# EAGLE design SBC_TMS9918A_ISA (EAGLE 9.6.2)
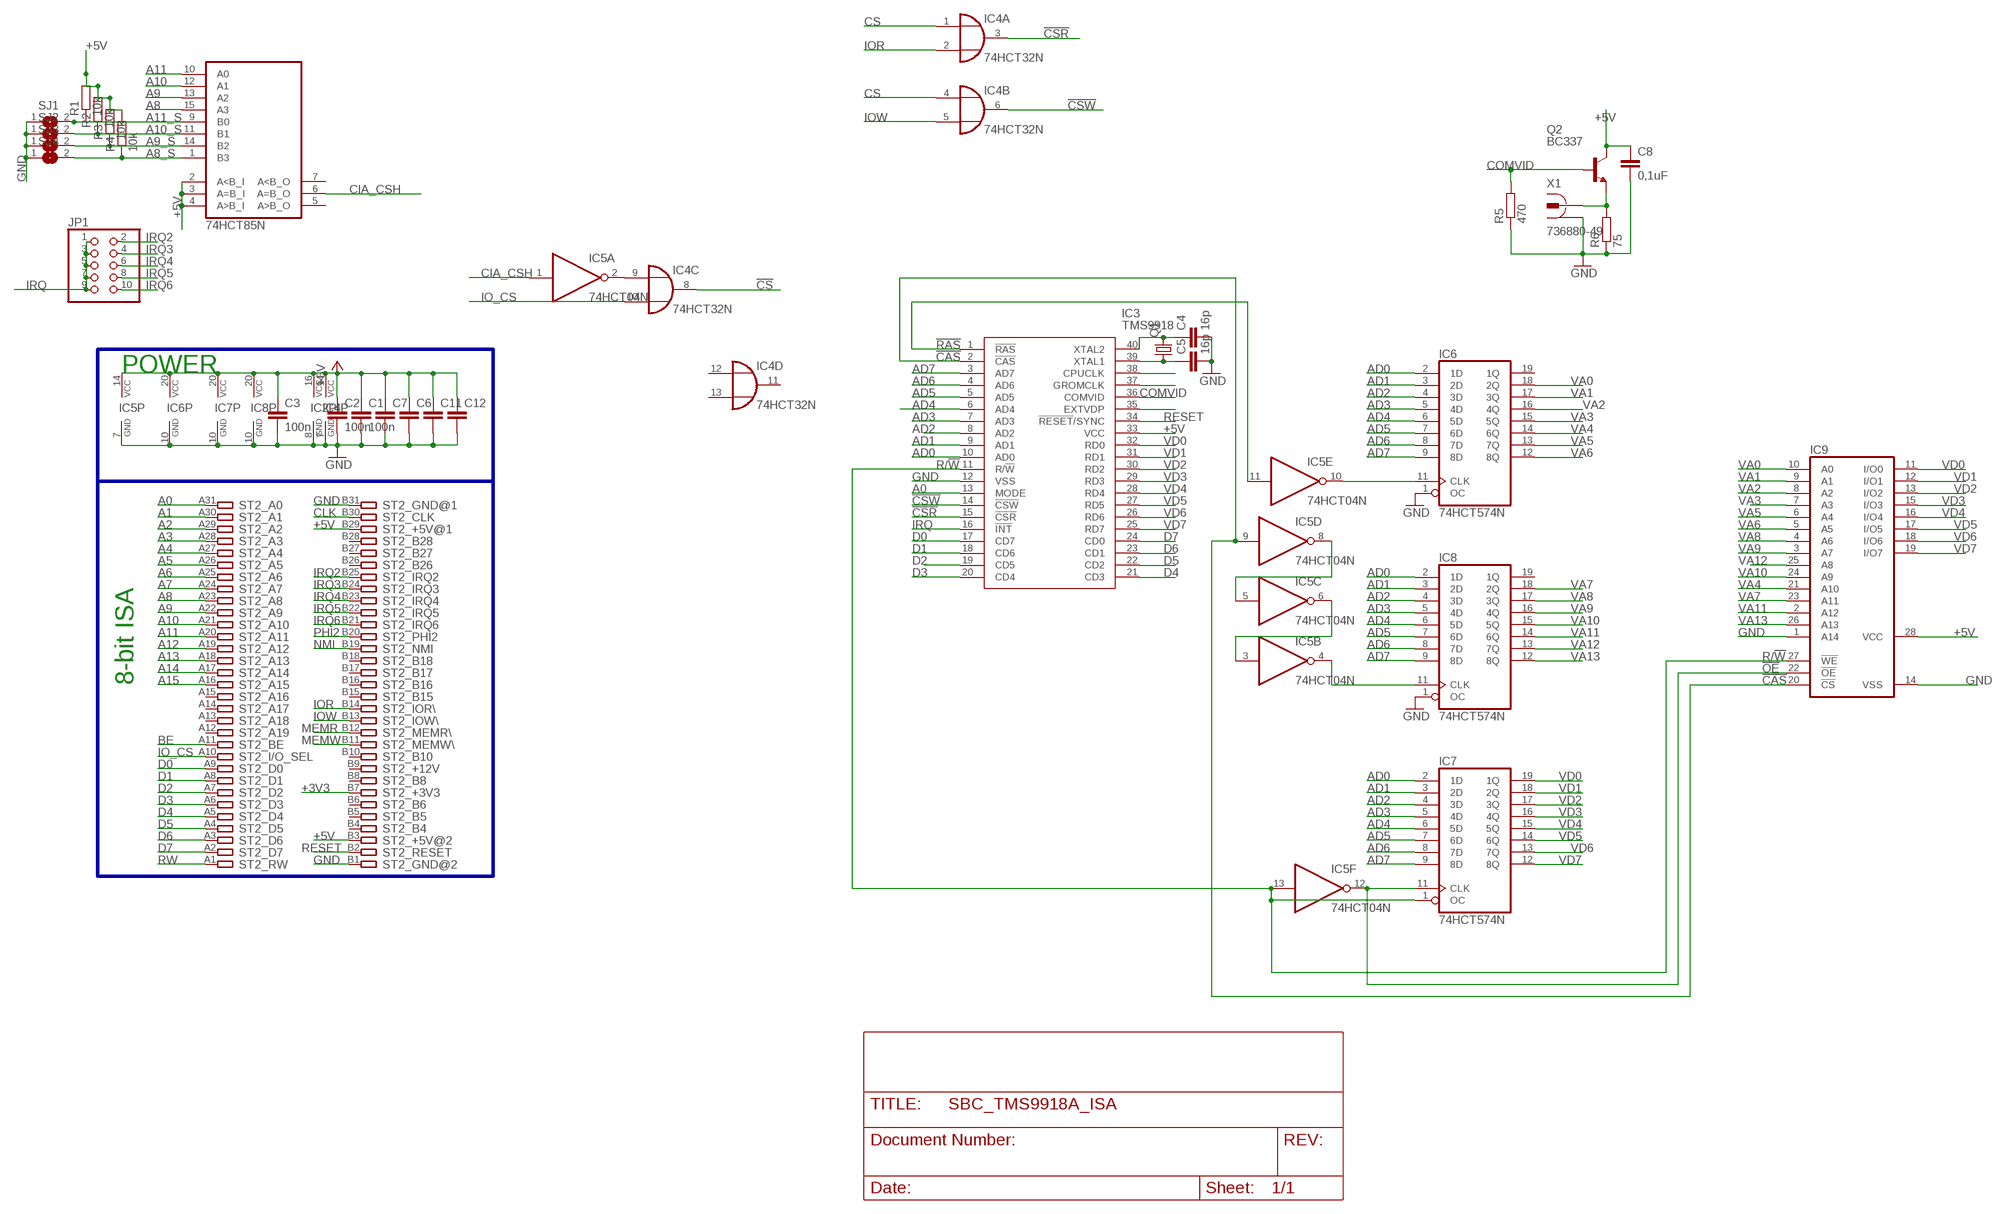
[diagram p0: schematic, sheet 1]

## Parts
C1  100n  C-EU050-025X075  [C050-025X075]
C2  100n  C-EU050-025X075  [C050-025X075]
C3  100n  C-EU050-025X075  [C050-025X075]
C4  16p  C-EU050-024X044  [C050-024X044]
C5  16p  C-EU050-024X044  [C050-024X044]
C6  C-EU050-035X075  [C050-035X075]
C7  C-EU050-035X075  [C050-035X075]
C8  0,1uF  C-EU050-024X044  [C050-024X044]
C11  C-EU050-035X075  [C050-035X075]
C12  C-EU050-035X075  [C050-035X075]
IC2  74HCT85N  [DIL16]
IC3  TMS9918  [DIP1524W53P254L5310H508Q40N]
IC4  74HCT32N  [DIL14]
IC5  74HCT04N  [DIL14]
IC6  74HCT574N  [DIL20]
IC7  74HCT574N  [DIL20]
IC8  74HCT574N  [DIL20]
IC9  62256P  [DIL28-6]
JP1  PINHD-2X5  [2X05]
Q1  CRYSTALHC49S  [HC49/S]
Q2  BC337  [TO92]
R1  10k  R-EU_0207/7  [0207/7]
R2  10k  R-EU_0207/7  [0207/7]
R3  10k  R-EU_0207/7  [0207/7]
R4  10k  R-EU_0207/7  [0207/7]
R5  470  R-EU_0207/7  [0207/7]
R6  75  R-EU_0207/7  [0207/7]
SJ1  SJ  [SJ]
SJ2  SJ  [SJ]
SJ3  SJ  [SJ]
SJ4  SJ  [SJ]
ST2  IBM8BIT_ISASHORT  [APP_2X32_SHORT]
X1  736880-49  [736880-49]

## Nets
!CAS: IC3.2(!CAS) IC5.9(D:I) IC9.20(!CS)
!CS: IC4.8(C:O)
!CSR: IC3.15(!CSR) IC4.3(A:O)
!CSW: IC3.14(!CSW) IC4.6(B:O)
!OE: IC5.12(F:O) IC7.11(CLK) IC9.22(!OE)
!RAS: IC3.1(!RAS) IC5.11(E:I)
+3V3: ST2.B7
+5V [power]: C1.1 C2.1 C3.1 C6.1 C7.1 C8.1 C11.1 C12.1 IC2.2(A<B_I) IC2.3(A=B_I) IC2.4(A>B_I) IC2.16(VCC) IC3.33(VCC) IC4.14(P:VCC) IC5.14(P:VCC) IC6.20(VCC) IC7.20(VCC) IC8.20(VCC) IC9.28(VCC) Q2.3(C) R1.2 R2.2 R3.2 R4.2 ST2.B3 ST2.B29
A0: IC3.13(MODE) ST2.A31
A1: ST2.A30
A2: ST2.A29
A3: ST2.A28
A4: ST2.A27
A5: ST2.A26
A6: ST2.A25
A7: ST2.A24
A8: IC2.15(A3) ST2.A23
A8_S: IC2.1(B3) R4.1 SJ4.2
A9: IC2.13(A2) ST2.A22
A9_S: IC2.14(B2) R3.1 SJ3.2
A10: IC2.12(A1) ST2.A21
A10_S: IC2.11(B1) R2.1 SJ2.2
A11: IC2.10(A0) ST2.A20
A11_S: IC2.9(B0) R1.1 SJ1.2
A12: ST2.A19
A13: ST2.A18
A14: ST2.A17
A15: ST2.A16
AD0: IC3.10(AD0) IC6.2(1D) IC7.2(1D) IC8.2(1D)
AD1: IC3.9(AD1) IC6.3(2D) IC7.3(2D) IC8.3(2D)
AD2: IC3.8(AD2) IC6.4(3D) IC7.4(3D) IC8.4(3D)
AD3: IC3.7(AD3) IC6.5(4D) IC7.5(4D) IC8.5(4D)
AD4: IC3.6(AD4) IC6.6(5D) IC7.6(5D) IC8.6(5D)
AD5: IC3.5(AD5) IC6.7(6D) IC7.7(6D) IC8.7(6D)
AD6: IC3.4(AD6) IC6.8(7D) IC7.8(7D) IC8.8(7D)
AD7: IC3.3(AD7) IC6.9(8D) IC7.9(8D) IC8.9(8D)
BE: ST2.A11
CIA_CSH: IC2.6(A=B_O) IC5.1(A:I)
CLK: ST2.B30
COMVID: IC3.36(COMVID) Q2.2(B) R5.2
CS: IC4.1(A:I0) IC4.4(B:I0)
D0: IC3.17(CD7) ST2.A9
D1: IC3.18(CD6) ST2.A8
D2: IC3.19(CD5) ST2.A7
D3: IC3.20(CD4) ST2.A6
D4: IC3.21(CD3) ST2.A5
D5: IC3.22(CD2) ST2.A4
D6: IC3.23(CD1) ST2.A3
D7: IC3.24(CD0) ST2.A2
GND [power]: C1.2 C2.2 C3.2 C4.2 C5.2 C6.2 C7.2 C8.2 C11.2 C12.2 IC2.8(GND) IC3.12(VSS) IC4.7(P:GND) IC5.7(P:GND) IC6.1(OC) IC6.10(GND) IC7.10(GND) IC8.1(OC) IC8.10(GND) IC9.1(A14) IC9.14(VSS) R5.1 R6.1 SJ1.1 SJ2.1 SJ3.1 SJ4.1 ST2.B1 ST2.B31 X1.1 X1.1@1 X1.1@2
IO_CS: IC4.10(C:I1) ST2.A10
IOR: IC4.2(A:I1) ST2.B14
IOW: IC4.5(B:I1) ST2.B13
IRQ: IC3.16(!INT) JP1.1 JP1.3 JP1.5 JP1.7 JP1.9
IRQ2: JP1.2 ST2.B25
IRQ3: JP1.4 ST2.B24
IRQ4: JP1.6 ST2.B23
IRQ5: JP1.8 ST2.B22
IRQ6: JP1.10 ST2.B21
MEMR: ST2.B12
MEMW: ST2.B11
N$2: IC4.9(C:I0) IC5.2(A:O)
N$3: Q2.1(E) R6.2 X1.2
N$14: IC5.10(E:O) IC6.11(CLK)
N$15: IC5.5(C:I) IC5.8(D:O)
N$16: IC5.3(B:I) IC5.6(C:O)
N$17: IC5.4(B:O) IC8.11(CLK)
N$22: C4.1 IC3.40(XTAL2) Q1.2
N$23: C5.1 IC3.39(XTAL1) Q1.1
N$24: IC3.38(CPUCLK)
N$25: IC3.37(GROMCLK)
N$27: IC3.35(EXTVDP)
NMI: ST2.B19
PHI2: ST2.B20
R/!W: IC3.11(R/!W) IC5.13(F:I) IC7.1(OC) IC9.27(!WE)
RESET: IC3.34(!RESET!/SYNC) ST2.B2
RW: ST2.A1
VA0: IC6.18(2Q) IC9.10(A0)
VA1: IC6.17(3Q) IC9.9(A1)
VA2: IC6.16(4Q) IC9.8(A2)
VA3: IC6.15(5Q) IC9.7(A3)
VA4: IC6.14(6Q) IC9.21(A10)
VA5: IC6.13(7Q) IC9.6(A4)
VA6: IC6.12(8Q) IC9.5(A5)
VA7: IC8.18(2Q) IC9.23(A11)
VA8: IC8.17(3Q) IC9.4(A6)
VA9: IC8.16(4Q) IC9.3(A7)
VA10: IC8.15(5Q) IC9.24(A9)
VA11: IC8.14(6Q) IC9.2(A12)
VA12: IC8.13(7Q) IC9.25(A8)
VA13: IC8.12(8Q) IC9.26(A13)
VD0: IC3.32(RD0) IC7.19(1Q) IC9.11(I/O0)
VD1: IC3.31(RD1) IC7.18(2Q) IC9.12(I/O1)
VD2: IC3.30(RD2) IC7.17(3Q) IC9.13(I/O2)
VD3: IC3.29(RD3) IC7.16(4Q) IC9.15(I/O3)
VD4: IC3.28(RD4) IC7.15(5Q) IC9.16(I/O4)
VD5: IC3.27(RD5) IC7.14(6Q) IC9.17(I/O5)
VD6: IC3.26(RD6) IC7.13(7Q) IC9.18(I/O6)
VD7: IC3.25(RD7) IC7.12(8Q) IC9.19(I/O7)
Unconnected: IC2.5(A>B_O) IC2.7(A<B_O) IC4.11(D:O) IC4.12(D:I0) IC4.13(D:I1) IC6.19(1Q) IC8.19(1Q) ST2.A12 ST2.A13 ST2.A14 ST2.A15 ST2.B4 ST2.B5 ST2.B6 ST2.B8 ST2.B9 ST2.B10 ST2.B15 ST2.B16 ST2.B17 ST2.B18 ST2.B26 ST2.B27 ST2.B28

## Buses
A8,A9,A10,A11,ACIA_CS,IO_CS,IO_CS_N,N$3,N$4,N$8

## Notes on the sheet
- POWER
- 8-bit ISA

## Library data of the parts
C1-C3 = rcl:C-EU: CAPACITOR, European symbol
C4-C8 C11 C12 = rcl:C-EU: CAPACITOR, European symbol; SPICEPREFIX: C
IC2 = 74xx-eu:74*85: 4-bit magnitude COMPARATOR
IC3 = TMS9918:TMS9918: Video Display Processor, DIP-40 Source: Datasheet <http://www.bitsavers.org/components/ti/TMS9900/TMS9918A_TMS9928A_TMS9929A_Video_Display_Processors_Data_Manual_Nov82.pdf>; DESCRIPTION: Video Display Processor, DIP-40; HEIGHT: 5.08mm; MANUFACTURER_NAME: Texas Instruments; MANUFACTURER_PART_NUMBER: TMS9918
IC4 = 74xx-eu:74*32: Quad 2-input OR gate
IC5 = 74xx-eu:74*04: Hex INVERTER
IC6-IC8 = 74xx-eu:74*574: 8-bit D type FLIP FLOP bus driver
IC9 = memory-hitachi:62256P: MEMORY; OC_FARNELL: unknown; OC_NEWARK: unknown
JP1 = pinhead:PINHD-2X5: PIN HEADER
Q1 = crystal:CRYSTAL: CRYSTAL; OC_FARNELL: 1667008; OC_NEWARK: unknown
Q2 = transistor-npn:BC337*: NPN Transistor
R1-R6 = rcl:R-EU_: RESISTOR, European symbol; SPICEPREFIX: R
SJ1-SJ4 = jumper:SJ: SMD solder JUMPER
ST2 = TiRoRiN_Libs:IBM8BIT_ISA: 8-bit CARD IBM/PC-AT
X1 = con-conrad:736880-49: Cinch Connector ( RCA Jack ) Cinch-Einbaukupplung 90º 72345 Vernickelt BKL Electronic Source: Conrad <http://www.conrad.de/ce/de/product/736880>

## Net classes
0 default: width 0.152 mm, drill 0.2 mm, clearance 0.152 mm
1 power: width 0.508 mm, drill 0.66 mm, clearance 0.254 mm to class 0, clearance 0.254 mm
2 data: width 0.254 mm, drill 0.66 mm, clearance 0.254 mm to class 0, clearance 0.254 mm to class 1, clearance 0.254 mm

## Board
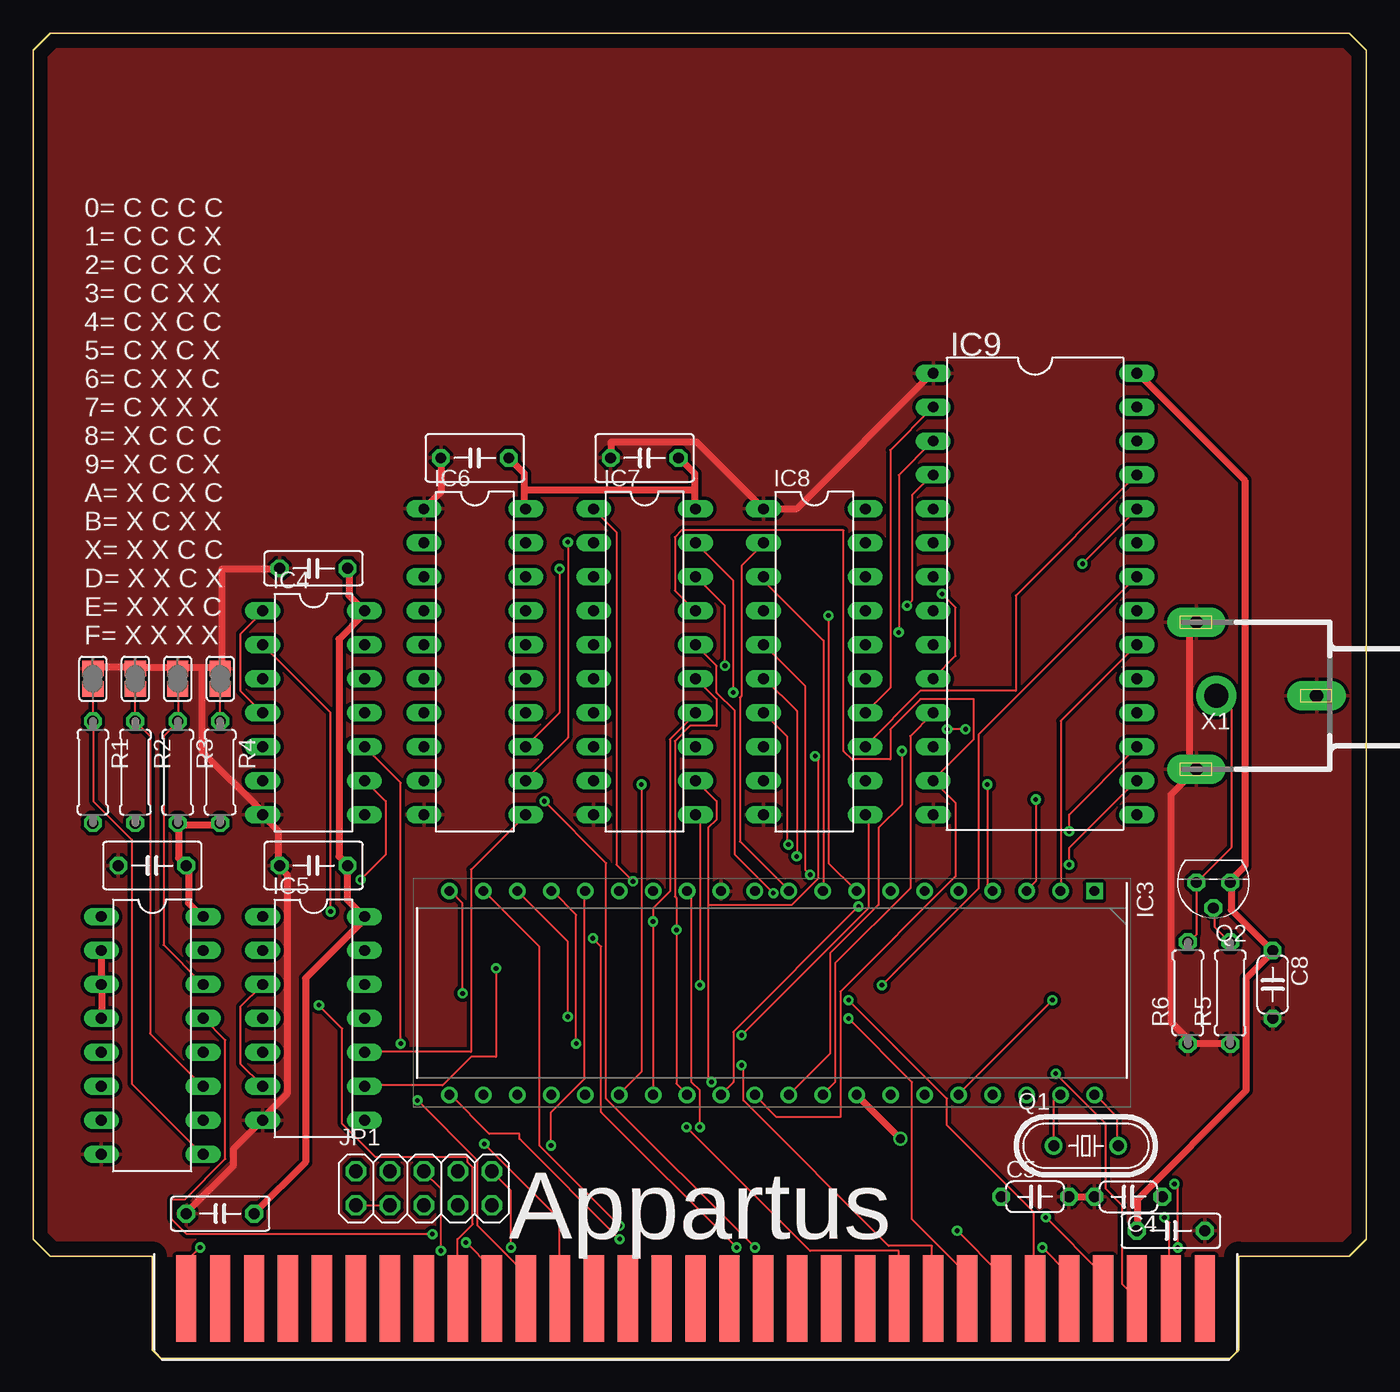
[diagram p1: board, top side]
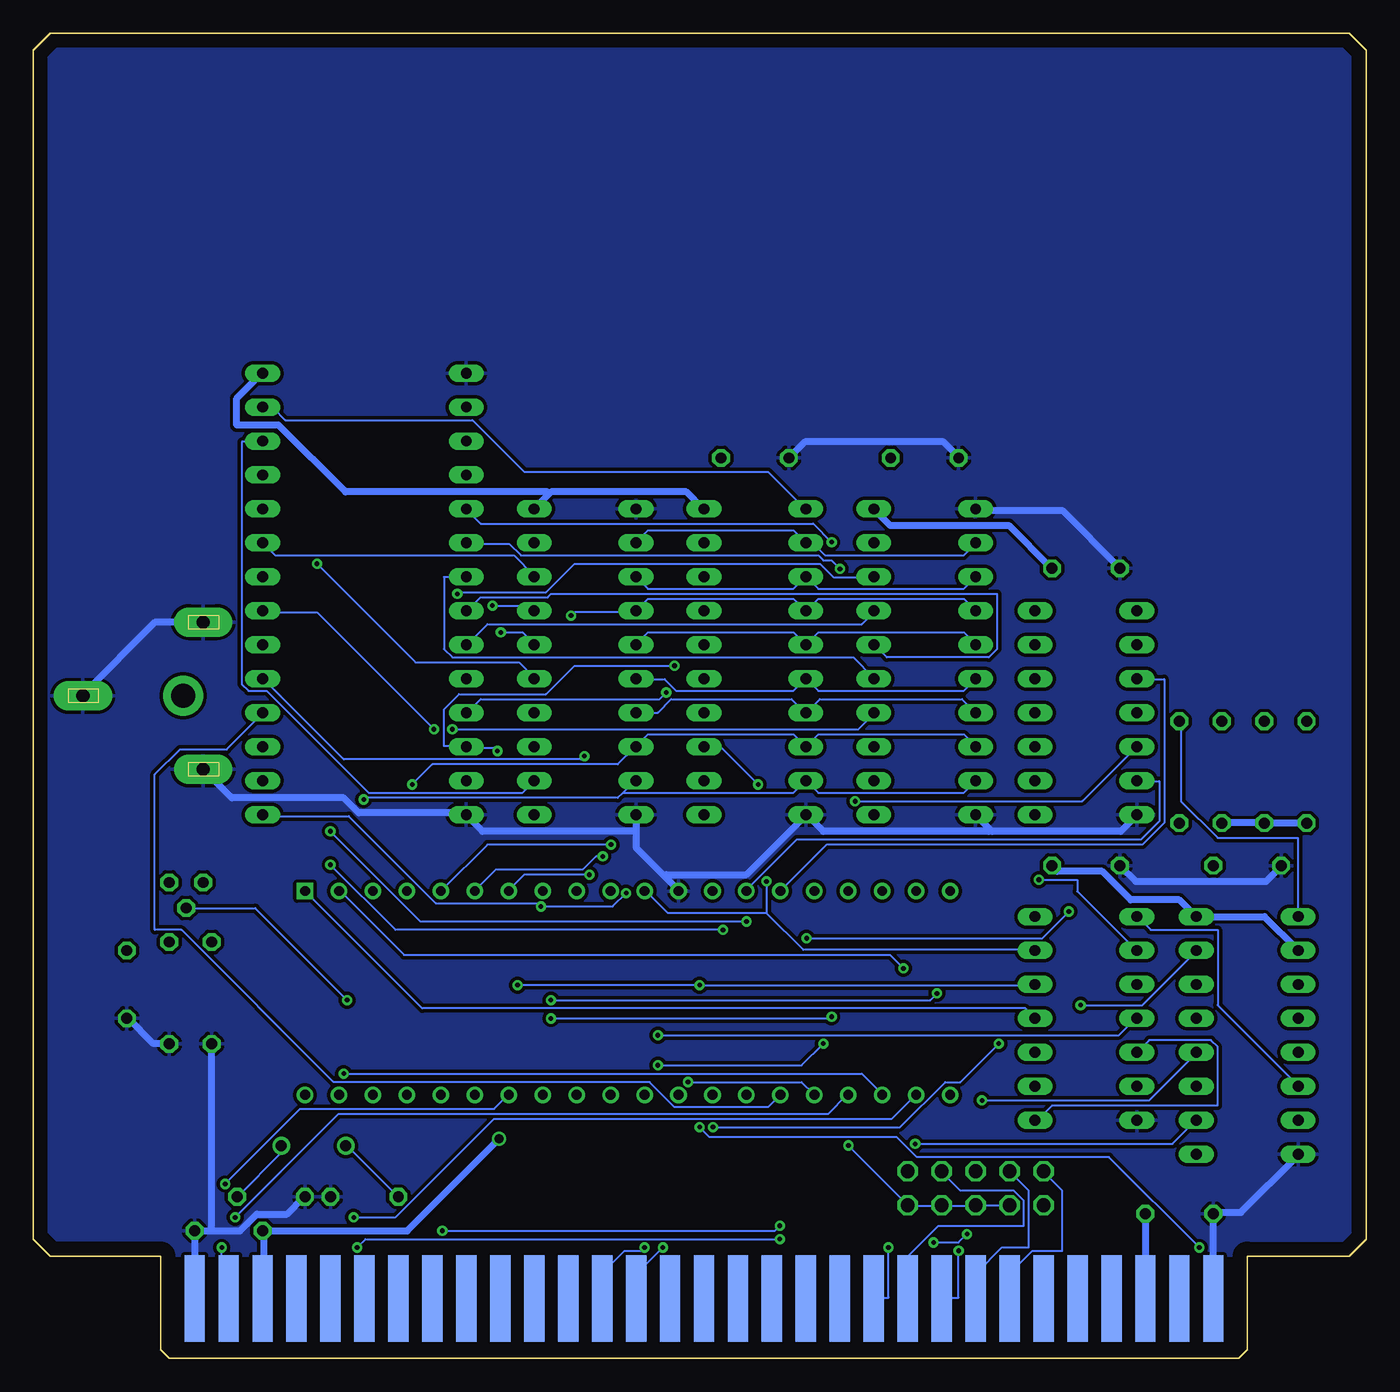
[diagram p2: board, bottom side, seen from below]

Size 99.7 x 99.06 mm. Coordinates in mm from the lower left corner, seen from the top.
Copper layers (1*16): Top 0.035mm / dielectric 1.5mm / Bottom 0.035mm
Design rules "appartus": minimum track width 6mil, minimum drill 0.35mm, track to track 6mil, track to pad 6mil, pad to pad 6mil, via to via 6mil, smd to smd 6mil, copper to edge 40mil, drill to drill 6mil, minimum pad ring 10mil, minimum via ring 8mil, stop-mask expansion 4mil, vias tented up to drill 0mil, thermal gap 10mil

### Footprints (pad centres in the part's own frame; a part is rotated, then mirrored left to right if it is on the bottom)
C050-025X075 = drill 0.813 octagon: 1 -2.54,0; 2 2.54,0
C050-024X044 = drill 0.813 octagon: 1 -2.54,0; 2 2.54,0
C050-035X075 = drill 0.813 octagon: 1 -2.54,0; 2 2.54,0
DIL16 = drill 0.813 long: 1 -8.89,-3.81; 2 -6.35,-3.81; 3 -3.81,-3.81; 4 -1.27,-3.81; 5 1.27,-3.81; 6 3.81,-3.81; 7 6.35,-3.81; 8 8.89,-3.81; 9 8.89,3.81; 10 6.35,3.81; 11 3.81,3.81; 12 1.27,3.81; 13 -1.27,3.81; 14 -3.81,3.81; 15 -6.35,3.81; 16 -8.89,3.81
DIP1524W53P254L5310H508Q40N = drill 0.733 pad 1.133 square: 1 -7.62,24.13 | drill 0.733 pad 1.133: 2 -7.62,21.59; 3 -7.62,19.05; 4 -7.62,16.51; 5 -7.62,13.97; 6 -7.62,11.43; 7 -7.62,8.89; 8 -7.62,6.35; 9 -7.62,3.81; 10 -7.62,1.27; 11 -7.62,-1.27; 12 -7.62,-3.81; 13 -7.62,-6.35; 14 -7.62,-8.89; 15 -7.62,-11.43; 16 -7.62,-13.97; 17 -7.62,-16.51; 18 -7.62,-19.05; 19 -7.62,-21.59; 20 -7.62,-24.13; 21 7.62,-24.13; 22 7.62,-21.59; 23 7.62,-19.05; 24 7.62,-16.51; 25 7.62,-13.97; 26 7.62,-11.43; 27 7.62,-8.89; 28 7.62,-6.35; 29 7.62,-3.81; 30 7.62,-1.27; 31 7.62,1.27; 32 7.62,3.81; 33 7.62,6.35; 34 7.62,8.89; 35 7.62,11.43; 36 7.62,13.97; 37 7.62,16.51; 38 7.62,19.05; 39 7.62,21.59; 40 7.62,24.13
DIL14 = drill 0.813 long: 1 -7.62,-3.81; 2 -5.08,-3.81; 3 -2.54,-3.81; 4 0,-3.81; 5 2.54,-3.81; 6 5.08,-3.81; 7 7.62,-3.81; 8 7.62,3.81; 9 5.08,3.81; 10 2.54,3.81; 11 0,3.81; 12 -2.54,3.81; 13 -5.08,3.81; 14 -7.62,3.81
DIL20 = drill 0.813 long: 1 -11.43,-3.81; 2 -8.89,-3.81; 3 -6.35,-3.81; 4 -3.81,-3.81; 5 -1.27,-3.81; 6 1.27,-3.81; 7 3.81,-3.81; 8 6.35,-3.81; 9 8.89,-3.81; 10 11.43,-3.81; 11 11.43,3.81; 12 8.89,3.81; 13 6.35,3.81; 14 3.81,3.81; 15 1.27,3.81; 16 -1.27,3.81; 17 -3.81,3.81; 18 -6.35,3.81; 19 -8.89,3.81; 20 -11.43,3.81
DIL28-6 = drill 0.813 long: 1 -16.51,-7.62; 2 -13.97,-7.62; 3 -11.43,-7.62; 4 -8.89,-7.62; 5 -6.35,-7.62; 6 -3.81,-7.62; 7 -1.27,-7.62; 8 1.27,-7.62; 9 3.81,-7.62; 10 6.35,-7.62; 11 8.89,-7.62; 12 11.43,-7.62; 13 13.97,-7.62; 14 16.51,-7.62; 15 16.51,7.62; 16 13.97,7.62; 17 11.43,7.62; 18 8.89,7.62; 19 6.35,7.62; 20 3.81,7.62; 21 1.27,7.62; 22 -1.27,7.62; 23 -3.81,7.62; 24 -6.35,7.62; 25 -8.89,7.62; 26 -11.43,7.62; 27 -13.97,7.62; 28 -16.51,7.62
2X05 = drill 1.016 octagon: 1 -5.08,-1.27; 2 -5.08,1.27; 3 -2.54,-1.27; 4 -2.54,1.27; 5 0,-1.27; 6 0,1.27; 7 2.54,-1.27; 8 2.54,1.27; 9 5.08,-1.27; 10 5.08,1.27
HC49/S = drill 0.813: 1 -2.413,0; 2 2.413,0
TO92 = drill 0.813 octagon: 1 1.27,0; 2 0,1.905; 3 -1.27,0
0207/7 = drill 0.813 octagon: 1 -3.81,0; 2 3.81,0
SJ = smd 1.168 x 1.6: 1 -0.762,0; 2 0.762,0
APP_2X32_SHORT = smd 1.524 x 6.477: A1 38.1,-44.45; A2 35.56,-44.45; A3 33.02,-44.45; A4 30.48,-44.45; A5 27.94,-44.45; A6 25.4,-44.45; A7 22.86,-44.45; A8 20.32,-44.45; A9 17.78,-44.45; A10 15.24,-44.45; A11 12.7,-44.45; A12 10.16,-44.45; A13 7.62,-44.45; A14 5.08,-44.45; A15 2.54,-44.45; A16 0,-44.45; A17 -2.54,-44.45; A18 -5.08,-44.45; A19 -7.62,-44.45; A20 -10.16,-44.45; A21 -12.7,-44.45; A22 -15.24,-44.45; A23 -17.78,-44.45; A24 -20.32,-44.45; A25 -22.86,-44.45; A26 -25.4,-44.45; A27 -27.94,-44.45; A28 -30.48,-44.45; A29 -33.02,-44.45; A30 -35.56,-44.45; A31 -38.1,-44.45 | smd 1.524 x 6.477 bottom: B1 38.1,-44.45; B2 35.56,-44.45; B3 33.02,-44.45; B4 30.48,-44.45; B5 27.94,-44.45; B6 25.4,-44.45; B7 22.86,-44.45; B8 20.32,-44.45; B9 17.78,-44.45; B10 15.24,-44.45; B11 12.7,-44.45; B12 10.16,-44.45; B13 7.62,-44.45; B14 5.08,-44.45; B15 2.54,-44.45; B16 0,-44.45; B17 -2.54,-44.45; B18 -5.08,-44.45; B19 -7.62,-44.45; B20 -10.16,-44.45; B21 -12.7,-44.45; B22 -15.24,-44.45; B23 -17.78,-44.45; B24 -20.32,-44.45; B25 -22.86,-44.45; B26 -25.4,-44.45; B27 -27.94,-44.45; B28 -30.48,-44.45; B29 -33.02,-44.45; B30 -35.56,-44.45; B31 -38.1,-44.45
736880-49 = drill 1 pad 2.2 long: 1 -3.92,0; 1@1 5.08,-5.5; 1@2 5.08,5.5 | drill 1.8 pad 3: 2 3.58,0

### Placement (x,y rotation side)
C1  13.97,10.8 180 top
C2  85.09,9.53 0 top
C3  20.96,59.05 180 top
C4  81.92,12.07 180 top
C5  74.93,12.07 0 top
C6  8.89,36.83 180 top
C7  20.96,36.83 180 top
C8  92.71,27.94 270 top
C11  33.02,67.31 180 top
C12  45.72,67.31 180 top
IC2  8.89,24.13 270 top
IC3  55.25,27.31 270 top
IC4  20.96,48.26 270 top
IC5  20.96,25.4 270 top
IC6  33.02,52.07 270 top
IC7  45.72,52.07 270 top
IC8  58.42,52.07 270 top
IC9  74.93,57.15 270 top
JP1  29.21,12.7 0 top
Q1  78.74,15.88 0 top
Q2  88.27,35.56 180 top
R1  4.45,43.82 270 top
R2  7.62,43.82 270 top
R3  10.8,43.82 270 top
R4  13.97,43.82 270 top
R5  89.54,27.31 90 top
R6  86.36,27.31 90 top
SJ1  4.45,50.8 270 top
SJ2  7.62,50.8 270 top
SJ3  10.8,50.8 270 top
SJ4  13.97,50.8 270 top
ST2  49.53,48.9 0 top
X1  92.08,49.53 180 top

### Tracks (layer width: path | path; a pad name or v marks a point on that pad's centre or on a via)
!CAS  (via drill 0.35)
  Top 0.152: IC9.20 76.86,47.65 76.86,35.02 IC3.2 | v34.61,29.15 34.61,22.52 32.73,22.52 30.61,20.4 24.86,20.4 IC5.9
  Bottom 0.152: v34.61,29.15 35.61,30.15 71.98,30.15 76.73,34.9 IC3.2
!CSR
  Bottom 0.152: IC3.15 43.73,35.02 40.36,38.4 16.73,38.4 15.11,40.02 15.11,50.77 17.11,50.77 IC4.3
!CSW
  Bottom 0.152: IC3.14 46.36,35.02 42.61,38.77 16.86,38.77 15.48,40.15 15.48,43.15 17.11,43.15 IC4.6
!OE  (via drill 0.35)
  Top 0.152: v49.86,27.9 49.86,40.27 49.61,40.52 IC7.11 | v63.48,27.9 70.73,35.15 70.73,46.65 82.48,58.4 IC9.22
  Bottom 0.152: IC5.12 24.86,27.9 v49.86,27.9 v63.48,27.9
!RAS
  Bottom 0.152: IC3.1 79.36,34.9 70.61,26.15 25.48,26.15 24.86,25.52 IC5.11
+5V  (via drill 0.66)
  Top 0.508: v64.86,16.4 61.61,19.65 IC3.33 | C2.1 82.61,9.65 82.61,11.9 90.73,20.02 90.73,28.4 92.61,30.27 C8.1 92.61,30.52 89.61,33.52 89.61,35.52 Q2.3 89.61,35.77 90.61,36.77 90.61,65.65 82.61,73.65 IC9.28 | IC2.4 5.11,25.52 5.11,27.9 IC2.3 5.11,28.15 5.11,30.4 IC2.2 | IC2.16 12.61,33.02 11.61,34.02 11.61,36.65 C6.1 11.36,36.9 10.86,37.4 10.86,39.9 R3.2 11.11,39.9 13.86,39.9 R4.2 | C1.1 16.61,10.9 20.36,14.65 20.36,28.4 24.73,32.77 IC5.14 24.73,33.02 23.48,34.27 23.48,36.77 C7.1 23.36,37.02 22.86,37.52 22.86,53.77 24.73,55.65 IC4.14 24.73,55.9 23.61,57.02 23.61,59.02 C3.1 | 36.73,64.9 36.73,63.52 IC6.20 | 36.73,64.9 36.73,66.15 35.61,67.27 C11.1 | 49.48,64.9 49.48,63.52 IC7.20 | 49.48,64.9 49.48,66.15 48.36,67.27 C12.1 | 49.48,64.9 36.73,64.9
  Bottom 0.508: v64.86,16.4 71.73,9.52 82.48,9.52 C2.1 82.48,9.27 82.48,4.52 ST2.B3 | C1.1 16.48,10.77 16.48,4.52 ST2.B29 | R1.2 4.48,40.02 7.61,40.02 R2.2 7.86,40.02 10.73,40.02 R3.2 | IC2.2 5.11,30.52 7.61,33.02 IC2.16 12.86,33.15 13.98,34.27 17.61,34.27 19.73,36.4 23.11,36.4 23.48,36.77 C7.1 | C3.1 23.61,59.15 26.73,62.27 35.61,62.27 36.73,63.4 IC6.20 | 61.11,64.65 60.98,64.77 50.86,64.77 49.61,63.52 IC7.20 | 61.11,64.65 62.23,63.52 IC8.20 | IC9.28 82.61,73.65 84.48,71.77 84.48,69.77 81.36,69.77 76.36,64.77 61.23,64.77 61.11,64.65
A0  (via drill 0.35)
  Top 0.152: v49.86,17.27 49.86,20.02 49.23,20.65 49.23,34.65 48.98,34.9 IC3.13 | v12.48,8.27 11.48,7.27 11.48,4.52 ST2.A31
  Bottom 0.152: v49.86,17.27 49.11,16.52 35.11,16.52 33.61,15.02 19.23,15.02 v12.48,8.27
A8  (via drill 0.35)
  Top 0.152: v21.36,26.4 23.11,24.65 23.11,17.52 25.61,15.02 32.48,15.02 32.48,14.65 32.86,14.27 32.86,10.02 31.73,8.9 31.73,4.52 ST2.A23
  Bottom 0.152: v21.36,26.4 16.73,26.4 12.73,30.4 IC2.15
A8_S
  Top 0.152: SJ4.2 13.98,50.02 13.98,47.65 R4.1
  Bottom 0.152: IC2.1 5.11,33.02 5.11,38.9 11.11,38.9 13.86,41.65 13.86,47.52 R4.1
A9  (via drill 0.35)
  Top 0.152: v29.86,9.27 11.48,9.27 10.36,10.4 10.36,11.9 11.36,11.9 14.36,14.9 14.36,23.77 12.73,25.4 IC2.13 | v32.36,8.65 34.23,6.77 34.23,4.52 ST2.A22
  Bottom 0.152: v29.86,9.27 30.48,8.65 v32.36,8.65
A9_S
  Top 0.152: SJ3.2 10.86,50.02 10.86,47.65 R3.1 10.73,47.52 9.73,46.52 9.73,30.9 12.61,28.02 IC2.14
A10  (via drill 0.35)
  Top 0.152: v28.73,19.27 33.23,14.77 33.23,9.9 36.73,6.4 36.73,4.52 ST2.A21
  Bottom 0.152: v28.73,19.27 16.23,19.27 12.73,22.77 IC2.12
A10_S
  Top 0.152: SJ2.2 7.61,50.02 7.61,47.65 R2.1 7.73,47.52 8.73,46.52 8.73,24.27 12.61,20.4 IC2.11
A11  (via drill 0.35)
  Top 0.152: v33.73,16.02 39.36,10.4 39.36,4.52 ST2.A20
  Bottom 0.152: v33.73,16.02 14.48,16.02 12.73,17.77 IC2.10
A11_S
  Top 0.152: SJ1.2 4.48,50.02 4.48,47.65 R1.1 4.48,47.52 4.48,41.65 7.36,38.77 7.36,20.52 12.61,15.27 IC2.9
AD0
  Top 0.152: IC3.10 56.48,35.02 52.86,38.65 52.86,49.4 52.98,49.52 52.98,59.27 54.61,60.9 IC8.2
  Bottom 0.152: IC6.2 29.23,60.9 30.11,60.02 40.48,60.02 41.36,60.9 41.86,60.9 IC7.2 41.98,61.02 42.86,61.9 53.73,61.9 54.61,61.02 IC8.2
AD1
  Top 0.152: IC3.9 59.11,35.02 59.11,53.65 54.73,58.02 54.73,58.4 IC8.3
  Bottom 0.152: IC6.3 29.23,58.4 30.11,57.52 40.98,57.52 41.86,58.4 IC7.3 41.98,58.4 42.86,57.52 53.73,57.52 54.61,58.4 IC8.3
AD2  (via drill 0.35)
  Top 0.152: v59.48,55.52 59.48,37.02 61.48,35.02 IC3.8
  Bottom 0.152: IC6.4 29.23,55.9 30.11,56.77 40.98,56.77 41.86,55.9 IC7.4 41.98,55.9 42.86,56.77 53.73,56.77 54.61,55.9 IC8.4 54.73,55.77 59.23,55.77 v59.48,55.52
AD3  (via drill 0.35)
  Top 0.152: v58.11,36.15 57.73,36.52 57.73,50.27 54.73,53.27 IC8.5
  Bottom 0.152: IC6.5 29.23,53.4 30.11,54.27 40.98,54.27 IC7.5 41.98,53.4 42.86,54.27 53.73,54.27 54.61,53.4 IC8.5 | v58.11,36.15 62.98,36.15 64.11,35.02 IC3.7
AD4  (via drill 0.35)
  Top 0.152: v57.11,37.52 57.11,48.4 54.73,50.77 IC8.6
  Bottom 0.152: IC6.6 29.23,50.77 30.11,49.9 40.98,49.9 41.86,50.77 IC7.6 41.98,50.77 42.86,49.9 51.61,49.9 52.48,50.77 54.61,50.77 IC8.6 | v57.11,37.52 57.61,37.52 58.61,36.52 65.11,36.52 66.61,35.02 IC3.6
AD5  (via drill 0.35)
  Top 0.152: v56.48,38.4 56.36,38.52 56.36,46.52 54.73,48.15 IC8.7
  Bottom 0.152: IC6.7 29.23,48.27 30.23,49.27 40.86,49.27 41.86,48.27 IC7.7 41.98,48.27 42.98,49.27 51.98,49.27 52.98,48.27 IC8.7 | v56.48,38.4 65.73,38.4 69.11,35.02 IC3.5
AD6  (via drill 0.35)
  Top 0.152: v71.36,42.9 71.36,35.4 71.73,35.02 IC3.4
  Bottom 0.152: IC6.8 29.23,45.77 30.11,46.65 40.98,46.65 41.86,45.77 IC7.8 41.98,45.77 42.86,46.65 53.73,46.65 54.61,45.77 IC8.8 54.73,45.65 55.98,44.4 69.86,44.4 v71.36,42.9
AD7  (via drill 0.35)
  Top 0.152: v74.98,41.77 74.98,35.65 74.36,35.02 IC3.3
  Bottom 0.152: IC6.9 29.23,43.15 30.11,42.27 40.98,42.27 41.86,43.15 IC7.9 41.98,43.15 42.86,42.27 55.61,42.27 | v74.98,41.77 74.86,41.9 55.98,41.9 55.61,42.27 | 55.61,42.27 54.73,43.15 IC8.9
CIA_CSH
  Bottom 0.152: IC2.6 5.11,20.4 11.11,26.4 11.11,32.02 16.11,32.02 17.11,33.02 IC5.1
COMVID  (via drill 0.35)
  Top 0.152: v76.23,26.77 69.23,19.77 IC3.36 | R5.2 89.48,31.15 88.36,32.27 88.36,33.65 Q2.2
  Bottom 0.152: v76.23,26.77 83.11,33.65 88.23,33.65 Q2.2
CS
  Top 0.152: IC4.4 17.11,48.27 15.48,49.9 15.48,54.15 17.11,55.77 IC4.1
D0  (via drill 0.35)
  Top 0.152: v40.61,23.52 40.61,33.15 38.86,34.9 IC3.17 | v52.98,21.9 53.11,21.77 53.11,19.27 63.98,8.4 67.23,8.4 67.23,4.52 ST2.A9
  Bottom 0.152: v40.61,23.52 42.23,21.9 v52.98,21.9
D1  (via drill 0.35)
  Top 0.152: v39.98,25.52 39.98,31.15 36.23,34.9 IC3.18 | v60.98,25.4 65.73,20.65 65.73,10.4 69.73,6.4 69.73,4.52 ST2.A8
  Bottom 0.152: v39.98,25.52 40.11,25.4 v60.98,25.4
D2  (via drill 0.35)
  Top 0.152: v43.86,9.9 37.86,15.9 37.86,30.77 33.73,34.9 IC3.19 | v69.11,9.52 72.36,6.27 72.36,4.52 ST2.A7
  Bottom 0.152: v43.86,9.9 44.23,9.52 v69.11,9.52
D3  (via drill 0.35)
  Top 0.152: v32.11,27.27 32.11,34.02 31.23,34.9 IC3.20 | v60.98,26.77 68.36,19.4 68.36,17.4 74.86,10.9 74.86,4.52 ST2.A6
  Bottom 0.152: v32.11,27.27 32.61,26.77 v60.98,26.77
D4  (via drill 0.35)
  Top 0.152: v43.86,8.9 36.36,16.4 36.36,16.77 34.11,16.77 31.23,19.65 IC3.21 | v75.48,8.27 77.36,6.4 77.36,4.52 ST2.A5
  Bottom 0.152: v43.86,8.9 74.86,8.9 v75.48,8.27
D5  (via drill 0.35)
  Top 0.152: v75.73,10.52 79.98,6.27 79.98,4.52 ST2.A4
  Bottom 0.152: v75.73,10.52 72.61,10.52 65.23,17.9 35.48,17.9 33.73,19.65 IC3.22
D6  (via drill 0.35)
  Top 0.152: v76.48,21.27 80.23,17.52 80.23,12.65 81.48,11.4 81.48,5.52 82.48,4.52 ST2.A3
  Bottom 0.152: v76.48,21.27 37.73,21.27 36.23,19.77 IC3.23
D7  (via drill 0.35)
  Top 0.152: v84.61,10.52 84.98,10.15 84.98,4.52 ST2.A2
  Bottom 0.152: v84.61,10.52 76.86,18.27 40.23,18.27 38.86,19.65 IC3.24
GND
  Top 0.508: R5.1 89.48,23.52 86.48,23.52 R6.1 86.48,23.77 85.11,25.15 85.11,42.15 86.86,43.9 X1.1@2 86.98,44.15 86.48,44.65 86.48,54.52 86.98,55.02 X1.1@1 | C5.2 77.48,12.02 79.36,12.02 C4.2 | C1.2 11.48,10.9 14.98,14.4 14.98,15.65 17.11,17.77 IC5.7 17.23,18.02 18.98,19.77 18.98,36.15 18.48,36.65 C7.2 18.36,36.9 18.36,39.4 17.23,40.52 IC4.7 17.11,40.9 12.61,45.4 12.61,51.65 | SJ1.1 4.48,51.65 7.61,51.65 SJ2.1 7.86,51.65 10.73,51.65 SJ3.1 10.98,51.65 12.61,51.65 | 12.61,51.65 13.86,51.65 SJ4.1 14.11,51.77 14.11,59.02 18.36,59.02 C3.2 | IC6.1 30.48,64.77 C11.2 | C12.2 43.23,67.4 43.23,68.52 49.61,68.52 54.61,63.52 IC8.1 54.86,63.52 57.11,63.52 67.23,73.65 IC9.1
  Bottom 0.508: C8.2 92.61,25.4 90.73,23.52 89.61,23.52 R5.1 | ST2.B1 87.61,4.52 87.61,9.52 C2.2 87.36,9.52 86.36,9.52 | 86.36,9.52 84.23,9.52 82.98,10.77 80.73,10.77 79.48,12.02 C4.2 | 86.36,9.52 86.36,23.4 R6.1 | X1.1 95.98,49.65 90.61,55.02 87.11,55.02 X1.1@1 | 52.48,36.02 54.61,38.15 54.61,39.4 | 52.48,36.02 51.48,35.02 IC3.12 | 54.61,39.4 54.61,40.52 IC8.10 | 52.48,36.02 52.36,36.15 46.36,36.15 41.98,40.52 IC7.10 41.73,40.52 40.61,39.4 28.23,39.4 28.11,39.52 | 54.61,39.4 66.11,39.4 67.23,40.52 IC9.14 67.48,40.77 75.36,40.77 76.48,41.9 84.86,41.9 86.98,44.02 X1.1@2 | IC2.8 5.11,15.15 9.36,10.9 11.36,10.9 C1.2 11.48,10.65 11.48,4.52 ST2.B31 | C7.2 17.23,35.65 7.48,35.65 6.36,36.77 C6.2 | 28.11,39.52 27.98,39.4 18.36,39.4 17.23,40.52 IC4.7 | 28.11,39.52 29.11,40.52 IC6.10 | C12.2 43.11,67.4 41.98,68.52 31.61,68.52 30.48,67.4 C11.2 | C3.2 18.48,59.15 22.73,63.4 29.11,63.4 IC6.1
  pour Top: -2.54,101.6 102.23,101.6 102.23,7.62 -2.54,7.62
  pour Bottom: 102.23,101.6 -2.54,101.6 -2.54,7.62 102.23,7.62
IO_CS  (via drill 0.35)
  Top 0.152: v27.48,23.52 27.48,43.02 24.86,45.65 IC4.10 | v48.86,17.27 58.11,8.02 64.73,8.02 64.73,4.52 ST2.A10
  Bottom 0.152: v27.48,23.52 30.36,20.65 31.48,20.65 34.86,17.27 v48.86,17.27
IOR  (via drill 0.35)
  Top 0.152: v22.23,33.4 22.23,48.27 17.23,53.27 IC4.2 | v41.86,31.4 42.48,30.77 42.48,18.4 v52.61,8.27
  Bottom 0.152: v22.23,33.4 24.23,31.4 v41.86,31.4 | v52.61,8.27 54.61,6.27 54.61,4.52 ST2.B14
IOW  (via drill 0.35)
  Top 0.152: v38.23,41.65 42.86,37.02 42.86,19.4 v53.98,8.27
  Bottom 0.152: v38.23,41.65 21.23,41.65 17.23,45.65 IC4.5 | v53.98,8.27 54.23,8.02 55.48,8.02 57.11,6.4 57.11,4.52 ST2.B13
IRQ  (via drill 0.35)
  Top 0.152: JP1.1 24.23,11.4 26.61,11.4 JP1.3 | v38.73,15.9 38.73,18.4 41.23,20.9 41.23,34.9 IC3.16
  Bottom 0.152: JP1.3 26.73,11.4 29.11,11.4 JP1.5 29.23,11.4 31.73,11.4 JP1.7 31.86,11.4 34.23,11.4 JP1.9 34.36,11.52 v38.73,15.9
IRQ2
  Bottom 0.152: JP1.2 24.11,13.9 22.73,12.52 22.73,8.02 24.98,8.02 26.61,6.4 26.61,4.52 ST2.B25
IRQ3
  Bottom 0.152: JP1.4 26.61,13.9 25.23,12.52 25.23,8.27 27.23,8.27 29.11,6.4 29.11,4.52 ST2.B24
IRQ4  (via drill 0.35)
  Top 0.152: v30.48,8.02 30.48,12.65 29.23,13.9 JP1.6
  Bottom 0.152: v30.48,8.02 30.48,4.52 31.73,4.52 ST2.B23
IRQ5
  Bottom 0.152: JP1.8 31.73,13.9 30.36,12.52 26.36,12.52 25.61,11.77 25.61,9.9 31.98,9.9 34.23,7.65 34.23,4.52 ST2.B22
IRQ6  (via drill 0.35)
  Top 0.152: v35.73,8.27 35.73,12.52 34.36,13.9 JP1.10
  Bottom 0.152: v35.73,8.27 35.73,4.52 36.73,4.52 ST2.B21
N$2  (via drill 0.35)
  Top 0.152: v24.48,35.77 26.36,37.65 26.36,41.65 24.86,43.15 IC4.9
  Bottom 0.152: v24.48,35.77 21.61,35.77 21.61,34.9 17.23,30.52 IC5.2
N$3
  Top 0.152: R6.2 86.48,31.15 86.98,31.65 86.98,35.52 Q2.1 87.11,35.65 89.61,38.15 89.61,48.52 88.61,49.52 X1.2
N$14
  Top 0.152: IC5.10 24.86,22.9 32.73,22.9 32.73,36.52 36.73,40.52 IC6.11
N$15
  Bottom 0.152: IC5.5 17.11,22.9 16.23,23.77 11.61,23.77 11.11,23.27 11.11,18.9 23.48,18.9 24.48,17.9 24.73,17.9 IC5.8
N$16
  Top 0.152: IC5.6 17.11,20.4 15.48,22.02 15.48,26.27 17.11,27.9 IC5.3
N$17  (via drill 0.35)
  Top 0.152: v52.98,24.15 62.48,33.65 62.48,40.27 62.23,40.52 IC8.11
  Bottom 0.152: v52.98,24.15 18.48,24.15 17.23,25.4 IC5.4
N$22
  Top 0.152: IC3.40 79.48,19.65 81.11,18.02 81.11,15.9 Q1.2
  Bottom 0.152: C4.1 84.36,12.15 81.23,15.27 81.23,15.77 Q1.2
N$23
  Top 0.152: IC3.39 76.73,19.65 76.36,19.27 76.36,15.9 Q1.1
  Bottom 0.152: C5.1 72.48,12.15 76.11,15.77 76.23,15.77 Q1.1
R/!W  (via drill 0.35)
  Top 0.152: v44.86,35.65 43.61,36.9 43.61,61.77 41.98,63.4 IC7.1
  Bottom 0.152: 44.86,33.27 52.23,33.27 53.86,34.9 IC3.11 | 44.86,33.27 42.11,30.52 24.86,30.52 IC5.13 | IC7.1 41.98,63.52 44.73,66.27 62.98,66.27 66.86,70.15 80.86,70.15 81.73,71.02 82.48,71.02 IC9.27 | v44.86,35.65 44.86,33.27
RESET  (via drill 0.35)
  Top 0.152: v85.36,13.02 85.61,12.77 v85.61,8.27
  Bottom 0.152: v85.36,13.02 79.73,18.65 65.23,18.65 64.23,19.65 IC3.34 | v85.61,8.27 85.61,4.52 85.11,4.52 ST2.B2
VA0  (via drill 0.35)
  Top 0.152: v67.98,57.15 68.98,56.15 68.98,52.52 67.36,50.9 IC9.10
  Bottom 0.152: v67.98,57.15 67.86,57.27 61.36,57.27 59.23,59.4 40.86,59.4 39.86,58.4 36.86,58.4 IC6.18
VA1
  Bottom 0.152: IC6.17 36.86,55.77 37.73,54.9 65.73,54.9 67.23,53.4 IC9.9
VA2
  Bottom 0.152: IC6.16 36.73,53.27 35.86,52.4 28.23,52.4 27.61,53.02 27.61,57.15 60.98,57.15 61.23,56.9 66.23,56.9 67.23,55.9 IC9.8
VA3
  Bottom 0.152: IC6.15 36.86,50.9 38.36,52.4 68.36,52.4 68.98,53.02 68.98,58.4 67.36,58.4 IC9.7
VA4  (via drill 0.35)
  Top 0.152: v69.73,47.02 v68.36,47.02
  Bottom 0.152: v68.36,47.02 37.98,47.02 36.86,48.15 IC6.14 | v69.73,47.02 78.48,55.77 82.48,55.77 IC9.21
VA5  (via drill 0.35)
  Top 0.152: v39.36,59.02 39.36,48.27 36.86,45.77 IC6.13
  Bottom 0.152: v39.36,59.02 39.98,59.65 40.61,59.65 40.98,60.02 63.23,60.02 64.11,60.9 67.23,60.9 IC9.6
VA6  (via drill 0.35)
  Top 0.152: v39.98,61.02 39.98,46.4 36.86,43.27 IC6.12
  Bottom 0.152: v39.98,61.02 41.36,62.4 66.23,62.4 67.23,63.4 IC9.5
VA7
  Bottom 0.152: IC8.18 62.23,58.52 63.73,60.02 81.61,60.02 82.48,60.9 IC9.23
VA8  (via drill 0.35)
  Top 0.152: v65.36,56.27 65.73,56.65 65.73,64.52 67.23,66.02 IC9.4
  Bottom 0.152: v65.36,56.27 62.61,56.27 62.23,55.9 IC8.17
VA9  (via drill 0.35)
  Top 0.152: v64.73,54.27 64.73,66.02 67.23,68.52 IC9.3
  Bottom 0.152: v64.73,54.27 63.11,54.27 62.23,53.4 IC8.16
VA10  (via drill 0.35)
  Top 0.152: v78.48,59.4 82.48,63.4 IC9.24
  Bottom 0.152: v78.48,59.4 71.11,52.02 63.36,52.02 62.23,50.9 IC8.15
VA11
  Top 0.152: IC8.14 64.11,50.15 64.11,67.9 67.23,71.02 IC9.2
VA12
  Top 0.152: IC8.13 62.23,45.77 66.36,49.9 73.48,49.9 73.48,57.02 82.48,66.02 IC9.25
VA13
  Bottom 0.152: IC8.12 62.23,43.15 63.11,42.27 74.61,42.27 82.23,49.9 83.61,49.9 84.11,50.4 84.11,68.52 82.61,68.52 IC9.26
VD0  (via drill 0.35)
  Top 0.152: IC3.32 59.11,19.77 59.98,20.65 59.98,29.52 65.61,35.15 65.61,46.52 67.23,48.15 IC9.11 | v52.36,49.77 52.36,58.15 49.61,60.9 IC7.19
  Bottom 0.152: v52.36,49.77 52.86,49.27 66.23,49.27 67.23,48.27 IC9.11
VD1  (via drill 0.35)
  Top 0.152: v64.98,45.4 64.98,41.4 63.23,39.65 63.23,33.9 59.61,30.27 59.61,22.77 56.61,19.77 IC3.31 | v51.73,51.77 51.73,56.27 49.61,58.4 IC7.18
  Bottom 0.152: v64.98,45.4 65.23,45.65 67.23,45.65 IC9.12 67.36,45.77 68.98,45.77 68.98,48.52 67.86,49.65 61.36,49.65 59.23,51.77 v51.73,51.77
VD2
  Top 0.152: IC3.30 53.98,19.65 55.61,18.02 60.36,18.02 60.36,27.4 68.98,36.02 68.98,41.52 67.36,43.15 IC9.13 67.36,43.27 70.36,46.27 70.36,49.27 66.36,49.27 64.11,47.02 64.11,44.77 61.23,44.77 60.61,45.4 60.61,61.9 48.48,61.9 47.98,61.4 47.98,57.4 49.48,55.9 IC7.17
VD3  (via drill 0.35)
  Top 0.152: v61.73,33.77 52.36,24.4 52.36,20.65 51.48,19.77 IC3.29 | v55.36,34.77 52.48,37.65 52.48,48.4 51.11,49.77 51.11,51.77 49.61,53.27 IC7.16
  Bottom 0.152: IC9.15 82.48,40.52 76.11,40.52 69.61,34.02 61.98,34.02 v61.73,33.77 56.36,33.77 v55.36,34.77
VD4  (via drill 0.35)
  Top 0.152: IC3.28 48.86,19.77 48.11,20.52 v48.11,32.02 48.11,34.4 47.98,34.52 47.98,46.15 49.11,47.27 51.11,47.27 51.11,49.27 49.61,50.77 IC7.15 | v77.48,36.9 77.48,38.15 82.48,43.15 IC9.16
  Bottom 0.152: v77.48,36.9 72.61,32.02 v48.11,32.02
VD5  (via drill 0.35)
  Top 0.152: IC3.27 v46.36,32.65 46.36,33.65 47.61,34.9 47.61,46.27 49.48,48.15 IC7.14 | v77.48,39.4 77.48,40.65 82.48,45.65 IC9.17
  Bottom 0.152: v77.48,39.4 70.73,32.65 v46.36,32.65
VD6  (via drill 0.35)
  Top 0.152: v45.48,42.9 45.48,21.4 43.86,19.77 IC3.26
  Bottom 0.152: v45.48,42.9 48.23,45.65 49.48,45.65 IC7.13 | IC3.26 44.73,18.77 51.73,18.77 53.61,20.65 77.23,20.65 88.61,32.02 90.61,32.02 90.61,43.65 88.73,45.52 85.23,45.52 82.61,48.15 IC9.18
VD7  (via drill 0.35)
  Top 0.152: v50.73,20.65 50.48,20.9 50.48,33.9 | 50.48,33.9 50.48,39.65 51.11,40.27 51.11,41.65 49.61,43.15 IC7.12 | v58.48,45.02 58.73,44.77 58.73,35.9 56.73,33.9 50.48,33.9
  Bottom 0.152: v50.73,20.65 42.23,20.65 41.36,19.77 IC3.25 | v58.48,45.02 58.73,44.77 76.48,44.77 82.48,50.77 IC9.19

### Text on the board
tNames: 0= C C C C / 1= C C C X / 2= C C X C / 3= C C X X / 4= C X C C / 5= C X C X / 6= C X X C / 7= C X X X / 8= X C C C / 9= X C C X / A= X C X C / B= X C X X / X= X X C C / D= X X C X / E= X X X C / F= X X X X